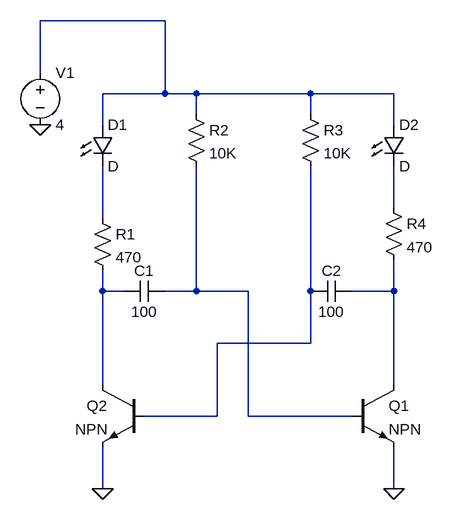
[diagram p0: schematic LED flasher.asc]
LED flasher.asc, the LTspice schematic file:
Version 4
SHEET 1 880 680
WIRE 224 -192 32 -192
WIRE 32 -112 32 -192
WIRE 224 -80 224 -192
WIRE 224 -80 128 -80
WIRE 272 -80 224 -80
WIRE 448 -80 272 -80
WIRE 576 -80 448 -80
WIRE 272 -48 272 -80
WIRE 448 -48 448 -80
WIRE 128 -32 128 -80
WIRE 576 -32 576 -80
WIRE 576 96 576 32
WIRE 128 112 128 32
WIRE 128 224 128 192
WIRE 160 224 128 224
WIRE 272 224 272 32
WIRE 272 224 224 224
WIRE 352 224 272 224
WIRE 448 224 448 32
WIRE 576 224 576 176
WIRE 576 224 512 224
WIRE 448 304 448 224
WIRE 448 304 304 304
WIRE 128 368 128 224
WIRE 576 368 576 224
WIRE 304 416 304 304
WIRE 304 416 192 416
WIRE 352 416 352 224
WIRE 512 416 352 416
WIRE 128 528 128 464
WIRE 576 528 576 464
FLAG 128 528 0
FLAG 576 528 0
FLAG 32 -32 0
SYMBOL res 112 96 R0
SYMATTR InstName R1
SYMATTR Value 470
SYMBOL res 256 -64 R0
SYMATTR InstName R2
SYMATTR Value 10K
SYMBOL res 432 -64 R0
SYMATTR InstName R3
SYMATTR Value 10K
SYMBOL res 560 80 R0
SYMATTR InstName R4
SYMATTR Value 470
SYMBOL LED 112 -32 R0
SYMATTR InstName D1
SYMBOL LED 560 -32 R0
SYMATTR InstName D2
SYMBOL cap 224 208 R90
WINDOW 0 0 32 VBottom 2
WINDOW 3 32 32 VTop 2
SYMATTR InstName C1
SYMATTR Value 100
SYMBOL cap 512 208 R90
WINDOW 0 0 32 VBottom 2
WINDOW 3 32 32 VTop 2
SYMATTR InstName C2
SYMATTR Value 100
SYMBOL npn 512 368 R0
SYMATTR InstName Q1
SYMBOL npn 192 368 M0
SYMATTR InstName Q2
SYMBOL voltage 32 -128 R0
WINDOW 123 0 0 Left 0
WINDOW 39 0 0 Left 0
SYMATTR InstName V1
SYMATTR Value 4

The netlist it stands for:
* LED flasher.asc
R1 N003 N004 470
R2 N001 N005 10K
R3 N001 N006 10K
R4 N002 N007 470
D1 N001 N003 D
D2 N001 N002 D
C1 N005 N004 100
C2 N007 N006 100
Q1 N007 N005 0 0 NPN
Q2 N004 N006 0 0 NPN
V1 N001 0 4
.model D D
.lib standard.dio
.model NPN NPN
.model PNP PNP
.lib standard.bjt
.backanno
.end